# Altium project TimeHAT.PrjPcb
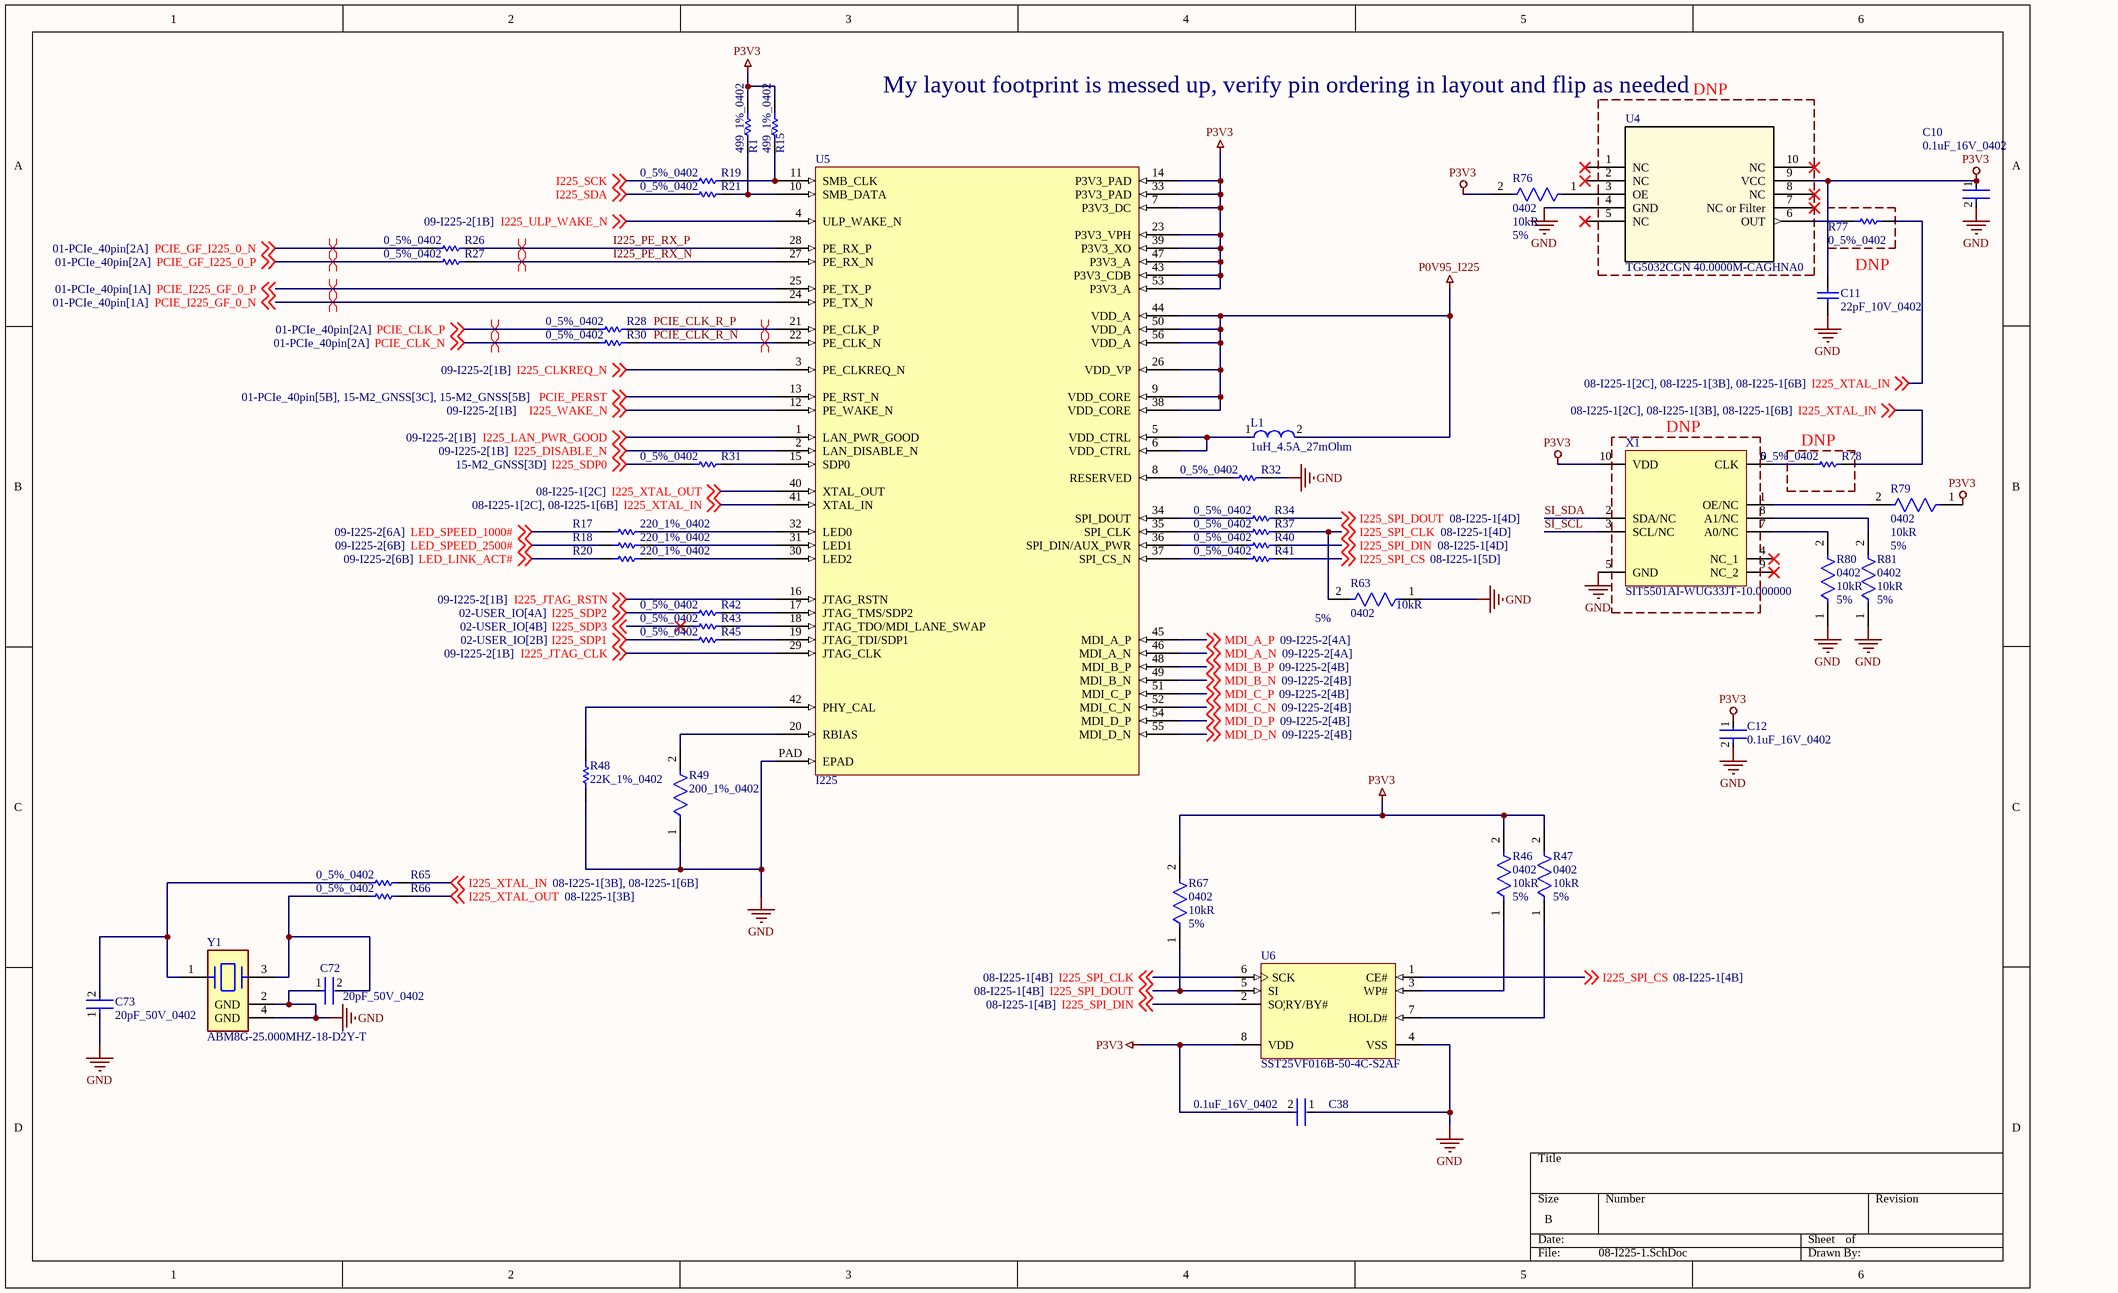
[diagram p0: 08-I225-1.SchDoc]
ProjectDate: 09/14/21; ProjectRevision: P3
3 sheets, 104 parts. Net scope: global (net labels, ports and power ports of the same name join across sheets).
Board file: TimeHAT.PcbDoc
Sheets:
  08-I225-1.SchDoc
  09-I225-2.SchDoc
  13-Power-P3V3.SchDoc

## Sheet 08-I225-1.SchDoc
size B; SheetNumber: 3; SheetTotal: 6

### Parts
C10  0.1uF_16V_0402  [FP-GRM15-MFG]
C11  22pF_10V_0402  [CAPC1005X56X25LL10T15]
C12  0.1uF_16V_0402  [FP-GRM15-MFG]
C38  0.1uF_16V_0402  [FP-GRM15-MFG]
C72  20pF_50V_0402  [FP-C0402-BB-MFG]
C73  20pF_50V_0402  [FP-C0402-BB-MFG]
L1  1uH_4.5A_27mOhm  [FP-IHLP-1616BZ-FP_1_8545x-MFG]
R1  499_1%_0402  [RESC1005X40X25LL05T05]
R15  499_1%_0402  [RESC1005X40X25LL05T05]
R17  220_1%_0402  [RESC1005X40X25NL10T10]
R18  220_1%_0402  [RESC1005X40X25NL10T10]
R19  0_5%_0402  [RESC1005X40X25LL10T10]
R20  220_1%_0402  [RESC1005X40X25NL10T10]
R21  0_5%_0402  [RESC1005X40X25LL10T10]
R26  0_5%_0402  [RESC1005X40X25LL10T10]
R27  0_5%_0402  [RESC1005X40X25LL10T10]
R28  0_5%_0402  [RESC1005X40X25LL10T10]
R30  0_5%_0402  [RESC1005X40X25LL10T10]
R31  0_5%_0402  [RESC1005X40X25LL10T10]
R32  0_5%_0402  [RESC1005X40X25LL10T10]
R34  0_5%_0402  [RESC1005X40X25LL10T10]
R37  0_5%_0402  [RESC1005X40X25LL10T10]
R40  0_5%_0402  [RESC1005X40X25LL10T10]
R41  0_5%_0402  [RESC1005X40X25LL10T10]
R42  0_5%_0402  [RESC1005X40X25LL10T10]
R43  0_5%_0402  [RESC1005X40X25LL10T10]
R45  0_5%_0402  [RESC1005X40X25LL10T10]
R46  Case/Package: 0402  Resistance: 10kR  Tolerance: 5%  [FP-CRCW0402-e3-IPC_B]  (hidden comment: CRCW040210K0JNED)
R47  Case/Package: 0402  Resistance: 10kR  Tolerance: 5%  [FP-CRCW0402-e3-IPC_B]  (hidden comment: CRCW040210K0JNED)
R48  22K_1%_0402  [RESC1005X40X25NL05T05]
R49  200_1%_0402  [FP-CRCW0402-e3-IPC_C]
R63  Case/Package: 0402  Resistance: 10kR  Tolerance: 5%  [FP-CRCW0402-e3-IPC_B]  (hidden comment: CRCW040210K0JNED)
R65  0_5%_0402  [RESC1005X40X25LL10T10]
R66  0_5%_0402  [RESC1005X40X25LL10T10]
R67  Case/Package: 0402  Resistance: 10kR  Tolerance: 5%  [FP-CRCW0402-e3-IPC_B]  (hidden comment: CRCW040210K0JNED)
R76  Case/Package: 0402  Resistance: 10kR  Tolerance: 5%  [FP-CRCW0402-e3-IPC_B]  (hidden comment: CRCW040210K0JNED)
R77  0_5%_0402  [RESC1005X40X25LL10T10]  (no BOM)
R78  0_5%_0402  [RESC1005X40X25LL10T10]  (no BOM)
R79  Case/Package: 0402  Resistance: 10kR  Tolerance: 5%  [FP-CRCW0402-e3-IPC_B]  (hidden comment: CRCW040210K0JNED)
R80  Case/Package: 0402  Resistance: 10kR  Tolerance: 5%  [FP-CRCW0402-e3-IPC_B]  (hidden comment: CRCW040210K0JNED)
R81  Case/Package: 0402  Resistance: 10kR  Tolerance: 5%  [FP-CRCW0402-e3-IPC_B]  (hidden comment: CRCW040210K0JNED)
U4  TG5032CGN 40.0000M-CAGHNA0  [QFN10_TG5032CGN 40.0000M-CAGHNA0_EPS]  (no BOM)
U5  I225  [I225 QFN56]
U6  SST25VF016B-50-4C-S2AF  [MCHP-SOIC-S2A8_M]
X1  SIT5501AI-WUG33JT-10.000000  [XTAL_SiT5501_70x50]  (no BOM)
Y1  ABM8G-25.000MHZ-18-D2Y-T  [FP-ABM8G-MFG]

### Blocks framed on the sheet
DNP: U4
DNP: X1

### Nets
GND: C10.2 C11.1 C12.2 C38.1 C72.1 C73.1 R32.2 R48.1 R49.1 R63.1 R80.1 R81.1 U4.4(GND) U5.PAD(EPAD) U6.4(VSS) X1.5(GND) Y1.2(GND) Y1.4(GND)
P0V95_I225: L1.2 U5.9(VDD_CORE) U5.26(VDD_VP) U5.38(VDD_CORE) U5.44(VDD_A) U5.50(VDD_A) U5.56(VDD_A)
P3V3: C10.1 C11.2 C12.1 C38.2 R1.2 R15.2 R46.2 R47.2 R67.2 R76.2 R79.1 U4.9(VCC) U5.7(P3V3_DC) U5.14(P3V3_PAD) U5.23(P3V3_VPH) U5.33(P3V3_PAD) U5.39(P3V3_XO) U5.43(P3V3_CDB) U5.47(P3V3_A) U5.53(P3V3_A) U6.8(VDD) X1.10(VDD)
I225_CLKREQ_N: U5.3(PE_CLKREQ_N) ; off-sheet I225_CLKREQ_N
I225_DISABLE_N: U5.2(LAN_DISABLE_N) ; off-sheet I225_DISABLE_N
I225_JTAG_CLK: U5.29(JTAG_CLK) ; off-sheet I225_JTAG_CLK
I225_JTAG_RSTN: U5.16(JTAG_RSTN) ; off-sheet I225_JTAG_RSTN
I225_LAN_PWR_GOOD: U5.1(LAN_PWR_GOOD) ; off-sheet I225_LAN_PWR_GOOD
I225_PE_RX_N: R27.2 U5.27(PE_RX_N)
I225_PE_RX_P: R26.2 U5.28(PE_RX_P)
I225_SCK: R19.1 ; off-sheet I225_SCK
I225_SDA: R21.1 ; off-sheet I225_SDA
I225_SDP0: R31.1 ; off-sheet I225_SDP0
I225_SDP1: R45.1 ; off-sheet I225_SDP1
I225_SDP2: R42.1 ; off-sheet I225_SDP2
I225_SDP3: R43.1 ; off-sheet I225_SDP3
I225_SPI_CLK: R37.2 R63.2 U6.6(SCK) ; off-sheet I225_SPI_CLK
I225_SPI_CS: R41.2 U6.1(CE#) ; off-sheet I225_SPI_CS
I225_SPI_DIN: R40.2 U6.2(SO|RY/BY#) ; off-sheet I225_SPI_DIN
I225_SPI_DOUT: R34.2 R67.1 U6.5(SI) ; off-sheet I225_SPI_DOUT
I225_ULP_WAKE_N: U5.4(ULP_WAKE_N) ; off-sheet I225_ULP_WAKE_N
I225_WAKE_N: U5.12(PE_WAKE_N) ; off-sheet I225_WAKE_N
I225_XTAL_IN: R65.2 R77.2 R78.2 U5.41(XTAL_IN) ; off-sheet I225_XTAL_IN
I225_XTAL_OUT: R66.2 U5.40(XTAL_OUT) ; off-sheet I225_XTAL_OUT
LED_LINK_ACT#: R20.1 ; off-sheet LED_LINK_ACT#
LED_SPEED_1000#: R17.1 ; off-sheet LED_SPEED_1000#
LED_SPEED_2500#: R18.1 ; off-sheet LED_SPEED_2500#
MDI_A_N: U5.46(MDI_A_N) ; off-sheet MDI_A_N
MDI_A_P: U5.45(MDI_A_P) ; off-sheet MDI_A_P
MDI_B_N: U5.49(MDI_B_N) ; off-sheet MDI_B_N
MDI_B_P: U5.48(MDI_B_P) ; off-sheet MDI_B_P
MDI_C_N: U5.52(MDI_C_N) ; off-sheet MDI_C_N
MDI_C_P: U5.51(MDI_C_P) ; off-sheet MDI_C_P
MDI_D_N: U5.55(MDI_D_N) ; off-sheet MDI_D_N
MDI_D_P: U5.54(MDI_D_P) ; off-sheet MDI_D_P
PCIE_CLK_N: R30.1 ; off-sheet PCIE_CLK_N
PCIE_CLK_P: R28.1 ; off-sheet PCIE_CLK_P
PCIE_CLK_R_N: R30.2 U5.22(PE_CLK_N)
PCIE_CLK_R_P: R28.2 U5.21(PE_CLK_P)
PCIE_GF_I225_0_N: R26.1 ; off-sheet PCIE_GF_I225_0_N
PCIE_GF_I225_0_P: R27.1 ; off-sheet PCIE_GF_I225_0_P
PCIE_I225_GF_0_N: U5.24(PE_TX_N) ; off-sheet PCIE_I225_GF_0_N
PCIE_I225_GF_0_P: U5.25(PE_TX_P) ; off-sheet PCIE_I225_GF_0_P
PCIE_PERST: U5.13(PE_RST_N) ; off-sheet PCIE_PERST
SI_SCL: X1.3(SCL/NC)
SI_SDA: X1.2(SDA/NC)
NetC72_2: C72.2 R66.1 Y1.3
NetC73_2: C73.2 R65.1 Y1.1
NetL1_1: L1.1 U5.5(VDD_CTRL) U5.6(VDD_CTRL)
NetR1_1: R1.1 R21.2 U5.10(SMB_DATA)
NetR15_1: R15.1 R19.2 U5.11(SMB_CLK)
NetR17_2: R17.2 U5.32(LED0)
NetR18_2: R18.2 U5.31(LED1)
NetR20_2: R20.2 U5.30(LED2)
NetR31_2: R31.2 U5.15(SDP0)
NetR32_1: R32.1 U5.8(RESERVED)
NetR34_1: R34.1 U5.34(SPI_DOUT)
NetR37_1: R37.1 U5.35(SPI_CLK)
NetR40_1: R40.1 U5.36(SPI_DIN/AUX_PWR)
NetR41_1: R41.1 U5.37(SPI_CS_N)
NetR42_2: R42.2 U5.17(JTAG_TMS/SDP2)
NetR43_2: R43.2 U5.18(JTAG_TDO/MDI_LANE_SWAP)
NetR45_2: R45.2 U5.19(JTAG_TDI/SDP1)
NetR46_1: R46.1 U6.3(WP#)
NetR47_1: R47.1 U6.7(HOLD#)
NetR48_2: R48.2 U5.42(PHY_CAL)
NetR49_2: R49.2 U5.20(RBIAS)
NetR76_1: R76.1 U4.3(OE)
NetR77_1: R77.1 U4.6(OUT)
NetR78_1: R78.1 X1.6(CLK)
NetR79_2: R79.2 X1.1(OE/NC)
NetR80_2: R80.2 X1.7(A0/NC)
NetR81_2: R81.2 X1.8(A1/NC)

Not connected (* = marked no-connect by the designer): U4 1(NC)* 2(NC)* 5(NC)* 7(NC_or_Filter)* 8(NC)* 10(NC)*; X1 4(NC_1)* 9(NC_2)*

### Layout directives
differential pair: I225_PE_RX_N, I225_PE_RX_P, PCIE_CLK_N, PCIE_CLK_P, PCIE_CLK_R_N, PCIE_CLK_R_P, PCIE_GF_I225_0_N, PCIE_GF_I225_0_P, PCIE_I225_GF_0_N, PCIE_I225_GF_0_P

### Notes on the sheet
- My layout footprint is messed up, verify pin ordering in layout and flip as needed
- DNP
- (near R78) DNP

### Library data of the parts
C10 C12 C38 = CMP-2100-03641-2: CAP CER 0.1UF 16V X7R 0402; Manufacturer Part Number: GRM155R71C104KA88D; Manufacturer: Murata; Standoff Height: 0mm; Tolerance: 10%; Voltage Rating: 16Vdc; Material: Ceramic; Capacitance: 0.10μF; Value: 0.10μF; RoHS: TRUE; Temperature Characteristic: X7R; Octopart: https://octopart.com/grm155r71c104ka88d-murata-196880; Digikey Description: CAP CER 0.1UF 16V X7R 0402; Device Class L3: Ceramic Capacitors; Height: 0.55mm; ComponentLink2Description: Datasheet; Temperature Range Low: -55°C; Ipc Land Pattern Name: CAPC10050X219; ComponentLink2URL: https://search.murata.co.jp/Ceramy/image/img/A01X/G101/ENG/GRM155R71H471KA01-01A.pdf; Device Class L1: Passive Components; Lead Free: yes; Category: Cap; Package: GRM15; Temperature: -55°C to +125°C; Device Class L2: Capacitors; Temperature Range High: +125°C; Mouser Description: 0402 0.1 uF 16V ±10 % Tolerance X7R SMT Multilayer Ceramic Capacitor
C11 = CMP-2008-02855-1: Part Number: 0402ZA220JAT2A; Manufacturer: AVX Interconnect / Elco
C72 C73 = CMP-1034-00890-3: CAP CER 20PF 50V 5% NP0 0402; Manufacturer Part Number: C0402C200J5GACTU; Manufacturer: Kemet; Tolerance: 0.05; Material: Ceramic; Temperature Characteristic: C0G; Temperature Coefficient: 15%; Octopart: https://octopart.com/c0402c200j5gactu-kemet-9143900; ComponentLink2Description: Datasheet; RoHS: TRUE; Ipc Land Pattern Name: CAPC10050X50; Temperature: -55°C to +125°C; Lead Free: Yes; Mouser Description: Multilayer Ceramic Capacitors MLCC - SMD/SMT 50volts 20pF C0G 5%; Device Class L1: Passive Components; Category: Cap; Package: C0402-BB; Temperature Range High: +125°C; Voltage Rating: 50 V; Temperature Range Low: -55°C; Device Class L2: Capacitors; Device Class L3: Ceramic Capacitors; Height: 0.55mm; Capacitance: 20 pF; Value: 20 pF; ComponentLink2URL: https://content.kemet.com/datasheets/KEM_C1002_X7R_SMD.pdf; Digikey Description: CAP CER 20PF 50V 5% NP0 0402; Automotive: No
L1 = CMP-02424-000223-1: Fixed Inductors Commercial Low DCR Series SMT 1uH 4.5A 27mΩ 20%; DC Resistance (DCR): 27mR; Core Material: Ferrite; Test Frequency: 100kHz; Shielding: Shielded; Self Resonant Frequency: 64MHz; Saturation Current: 5A; Inductance Tolerance: 20%; Min Operating Temperature: -55°C; Lead Free: Lead Free; Inductance: 1uH; Contact Plating: Tin; Package Quantity: 4000; Military Standard: Not; Depth: 4.31mm; Tolerance: 20%; RMS Current (Irms): 4.5A; Packaging: Tape and Reel; Number of Pins: 1616; Case/Package: 1616; Termination: SMD/SMT; Height: 2mm; Current Rating: 4.5A; Case Code (Metric): 4040; Max Operating Temperature: 125°C; Case Code (Imperial): 1616; Max DC Current: 4.5A; Width: 0.16inch; Mount: Surface Mount; Length: 4.7mm; Radiation Hardening: No; Height - Seated (Max): 0.079inch
R1 R15 = CMP-2002-00965-1: Manufacturer: Panasonic; Part Number: ERJ-2RKF4990X
R17 R18 R20 = CMP-2002-06050-1: Part Number: MC00625W04021220R; Manufacturer: Multicomp
R19 R21 R26-R28 R30-R32 R34 R37 R40-R43 R45 R65 R66 R77 R78 = CMP-2002-04569-1: Manufacturer: KOA Speer; Part Number: RK73Z1ETTP
R46 R47 R63 R67 R76 R79-R81 = CMP-2002-08136-3: RES Thick Film, 10kΩ, 5%, 0.063W, 200ppm/°C, 0402; Voltage Rating: 50V; Power Rating: 63mW; Military Standard: Not; Packaging: Tape and Reel; Case Code (Imperial): 0402; Min Operating Temperature: -55°C; Case Code (Metric): 1005; Temperature Coefficient: 200ppm/°C; Termination: SMD/SMT; Composition: Thick Film; Depth: 0.5mm; Number of Terminations: 2; Contact Plating: Tin; Height: 0.016inch; Width: 0.5mm; Max Operating Temperature: 155°C; Features: Automotive AEC-Q200; Length: 1mm; Radiation Hardening: No; Max Power Dissipation: 63mW; Mount: Surface Mount; Package Quantity: 1; Weight: 2.3E-05oz
R48 = CMP-1011-00659-2: Part Number: CRCW040222K0FKED; Manufacturer: Vishay Dale
R49 = CMP-1011-00429-3: RES Thick Film, 200Ω, 1%, 0.063W, 100ppm/°C, 0402; Max Power Dissipation: 63mW; Voltage Rating: 50V; Resistance: 200R; Termination: SMD/SMT; Weight: 2.3E-05oz; Case/Package: 0402; Contact Plating: Tin; Number of Pins: 2; Width: 0.5mm; Height: 0.35mm; Case Code (Metric): 1005; Military Standard: Not; Features: Automotive AEC-Q200; Power Rating: 63mW; Temperature Coefficient: 100ppm/°C; Tolerance: 1%; Lead Free: Lead Free; Depth: 0.5mm; Max Operating Temperature: 155°C; Min Operating Temperature: -55°C; Package Quantity: 10; Voltage Rating (DC): 50V; Composition: Thick Film; Mount: Surface Mount; Radiation Hardening: No; Length: 1mm; Packaging: Tape and Reel; Number of Terminations: 2; Case Code (Imperial): 0402
U4 = TG5032CGN 40.0000M-CAGHNA0: No Description Available; Mfr_Name: Epson; Copyright: Copyright (C) 2024 Ultra Librarian. All rights reserved.; Manufacturer_Part_Number: TG5032CGN 40.0000M-CAGHNA0; RefDes: RefDes; Type: DEV
U6 = CMP-0378-00041-1: 16 Mbit SPI Serial Flash, 2.7 to 3.6 V, 50 MHz, 0 to 70 degC, 8-pin SOIC (S2A8), Tube; Manufacturer: Microchip; PackageReference: SOIC-S2A8; PackageVersion: Rev. A; ComponentLink3URL: http://ww1.microchip.com/downloads/en/DeviceDoc/25051A.pdf; ComponentLink1Description: Manufacturer URL; ComponentLink4URL: http://www.microchip.com/SST25VF016B; ComponentLink1URL: http://www.microchip.com; DatasheetVersion: Rev. A; ComponentLink2URL: http://ww1.microchip.com/downloads/en/DeviceDoc/25044A.pdf; PackageDescription: 8-Lead Plastic Small Outline Intergrated Circuit, 5.275 x 5.275 mm Body, 1.27 mm Pitch; PartNumber: SST25VF016B-50-4C-S2AF; ComponentLink3Description: Package Specification; ComponentLink2Description: Datasheet; Mounting Technology: Surface Mount; ComponentLink4Description: Product URL
X1 = XTAL_SIT5501AI-WUG33JT-10.000000: 1 MHz  60 MHz, Elite X Stratum 3E Precision Oscillator; Manufacturer_Name: SiTime; Geometry.Height: 2.2mm; Manufacturer_Part_Number: SIT5501AI-WUG33JT-10.000000; Mouser Part Number: *; Mouser Price/Stock: *; Arrow Part Number: *; Arrow Price/Stock: *; Mouser Testing Part Number: *; Mouser Testing Price/Stock: *; Datasheet Link: https://www.sitime.com/support/resource-library/datasheets/sit5501-datasheet
Y1 = CMP-2000-05733-2: CRYSTAL 25.0000MHZ 18PF SMD; Manufacturer: Abracon; Stability: 30ppm; Frequency: 25MHz; Esr: 60Ω; Tolerance: 20ppm; Automotive: No; Series: ABM8G; Temperature Range High: +85°C; ComponentLink2URL: https://abracon.com/Resonators/ABM8G.pdf; RoHS: TRUE; Octopart: https://octopart.com/abm8g-25.000mhz-18-d2y-t-abracon-12676602; Package: ABM8G; Category: Crys; Device Class L2: Crystals / Oscillators; ComponentLink2Description: Datasheet; Manufacturer Part Number: ABM8G-25.000MHZ-18-D2Y-T; Height: 1mm; Lead Free: Yes; Digikey Description: CRYSTAL 25.0000MHZ 18PF SMD; Temperature Range Low: -40°C; Device Class L3: Crystals; Load Capacitance: 18pF; Temperature: -40°C to +85°C; Device Class L1: Passive Components; Mouser Description: Crystals 25.000MHz 18pF 30ppm -40C +85C

## Sheet 09-I225-2.SchDoc
size B; SheetNumber: 4; SheetTotal: 6
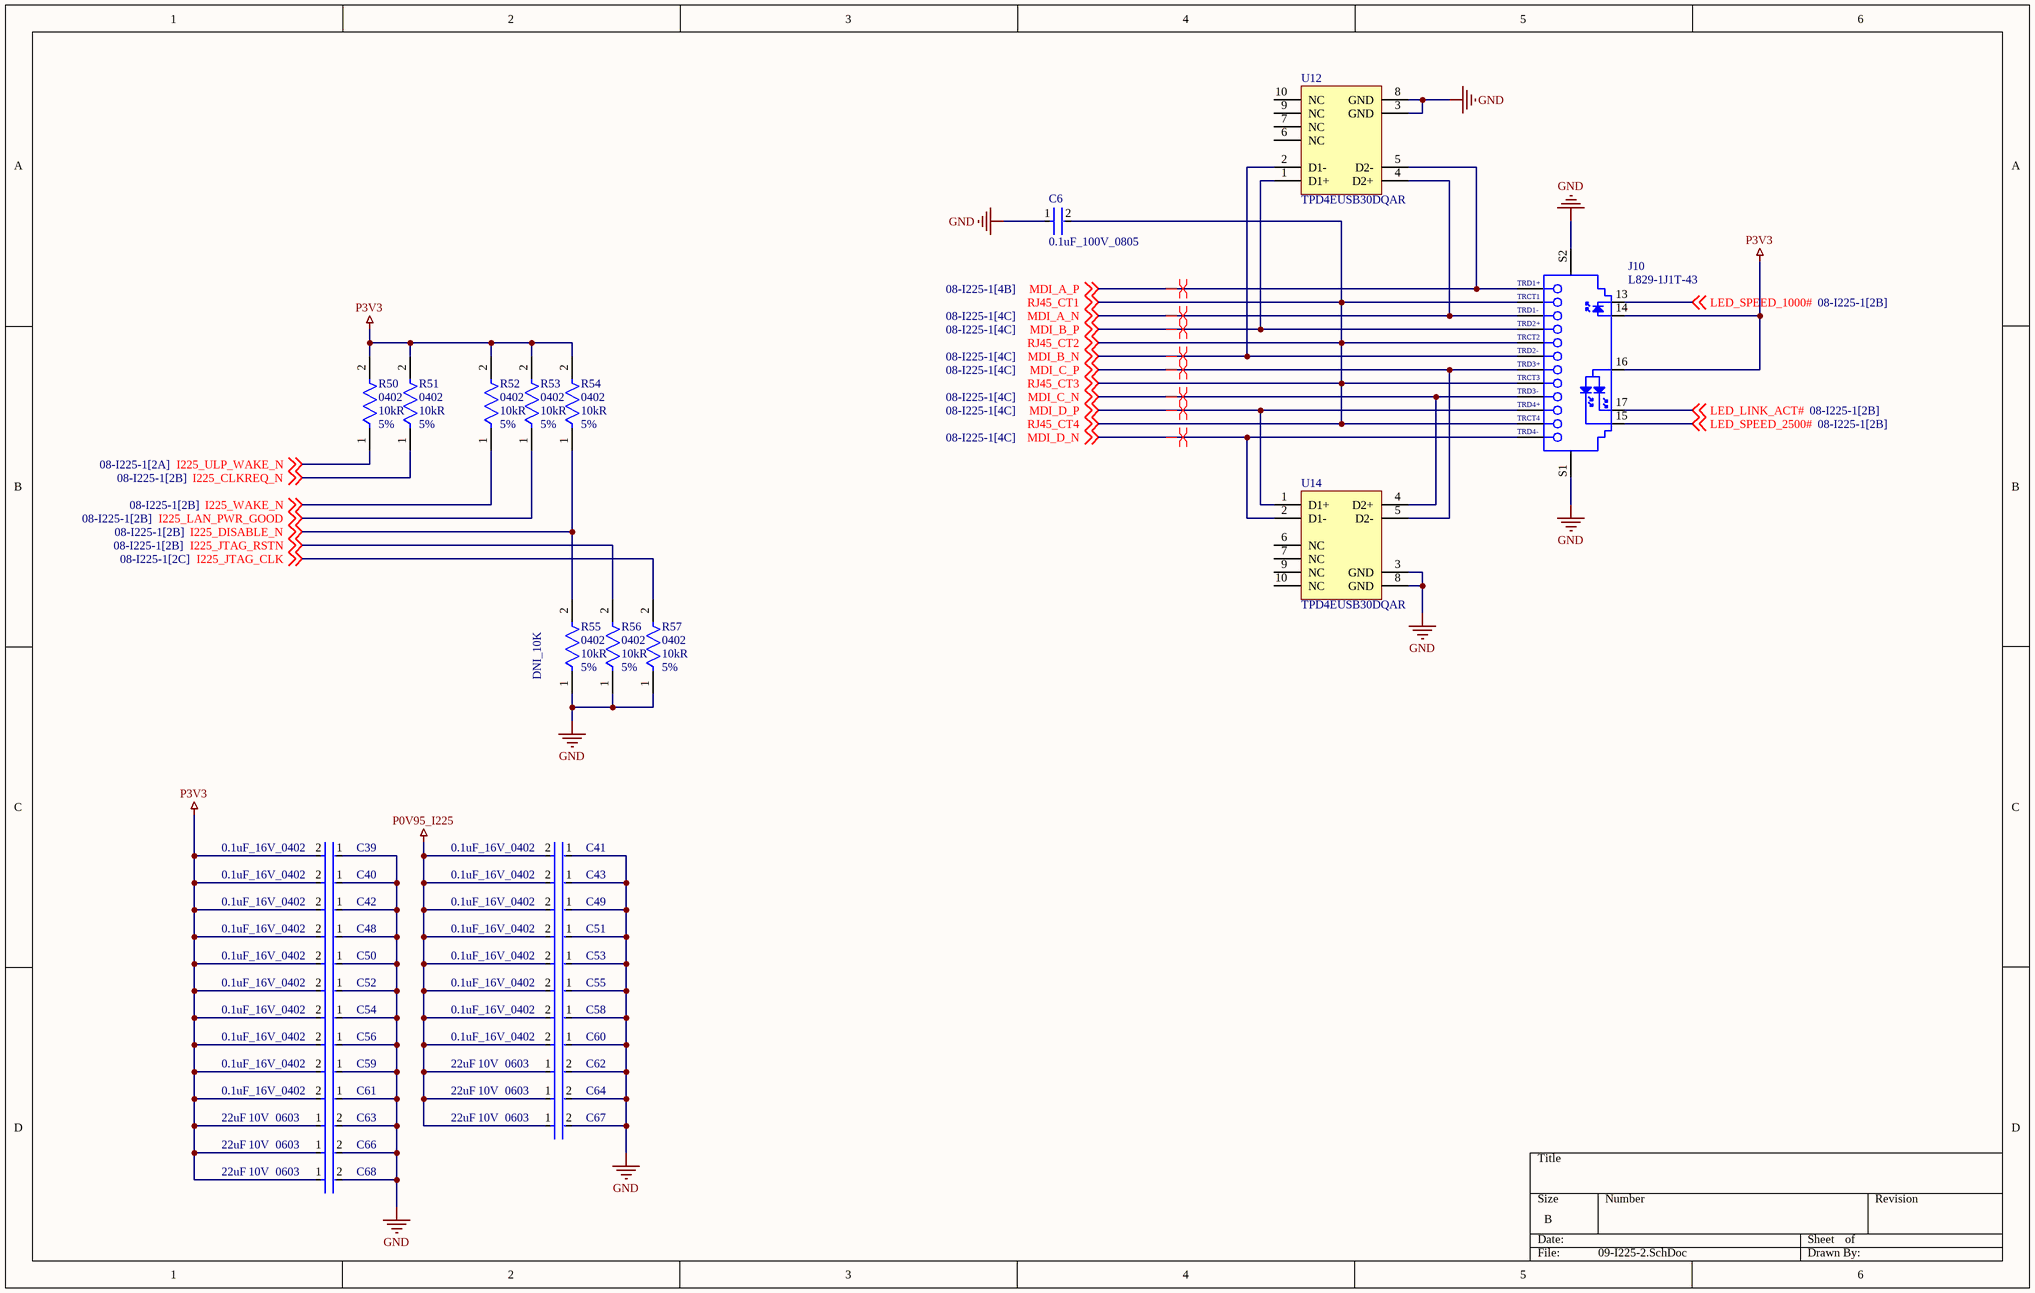
[diagram p1: 09-I225-2.SchDoc]

### Parts
C6  0.1uF_100V_0805  [FP-0805-L_2_0_0_1-W_1_25-MFG]
C39  0.1uF_16V_0402  [FP-GRM15-MFG]
C40  0.1uF_16V_0402  [FP-GRM15-MFG]
C41  0.1uF_16V_0402  [FP-GRM15-MFG]
C42  0.1uF_16V_0402  [FP-GRM15-MFG]
C43  0.1uF_16V_0402  [FP-GRM15-MFG]
C48  0.1uF_16V_0402  [FP-GRM15-MFG]
C49  0.1uF_16V_0402  [FP-GRM15-MFG]
C50  0.1uF_16V_0402  [FP-GRM15-MFG]
C51  0.1uF_16V_0402  [FP-GRM15-MFG]
C52  0.1uF_16V_0402  [FP-GRM15-MFG]
C53  0.1uF_16V_0402  [FP-GRM15-MFG]
C54  0.1uF_16V_0402  [FP-GRM15-MFG]
C55  0.1uF_16V_0402  [FP-GRM15-MFG]
C56  0.1uF_16V_0402  [FP-GRM15-MFG]
C58  0.1uF_16V_0402  [FP-GRM15-MFG]
C59  0.1uF_16V_0402  [FP-GRM15-MFG]
C60  0.1uF_16V_0402  [FP-GRM15-MFG]
C61  0.1uF_16V_0402  [FP-GRM15-MFG]
C62  Capacitance: 22uF  Voltage Rating: 10V  Case Code (Imperial): 0603  [FP-GRM188-0_2-IPC_C]  (hidden comment: GRM188R61A226ME15D)
C63  Capacitance: 22uF  Voltage Rating: 10V  Case Code (Imperial): 0603  [FP-GRM188-0_2-IPC_C]  (hidden comment: GRM188R61A226ME15D)
C64  Capacitance: 22uF  Voltage Rating: 10V  Case Code (Imperial): 0603  [FP-GRM188-0_2-IPC_C]  (hidden comment: GRM188R61A226ME15D)
C66  Capacitance: 22uF  Voltage Rating: 10V  Case Code (Imperial): 0603  [FP-GRM188-0_2-IPC_C]  (hidden comment: GRM188R61A226ME15D)
C67  Capacitance: 22uF  Voltage Rating: 10V  Case Code (Imperial): 0603  [FP-GRM188-0_2-IPC_C]  (hidden comment: GRM188R61A226ME15D)
C68  Capacitance: 22uF  Voltage Rating: 10V  Case Code (Imperial): 0603  [FP-GRM188-0_2-IPC_C]  (hidden comment: GRM188R61A226ME15D)
J10  L829-1J1T-43  [BELS-L829-1J1T-43_V]
R50  Case/Package: 0402  Resistance: 10kR  Tolerance: 5%  [FP-CRCW0402-e3-IPC_B]  (hidden comment: CRCW040210K0JNED)
R51  Case/Package: 0402  Resistance: 10kR  Tolerance: 5%  [FP-CRCW0402-e3-IPC_B]  (hidden comment: CRCW040210K0JNED)
R52  Case/Package: 0402  Resistance: 10kR  Tolerance: 5%  [FP-CRCW0402-e3-IPC_B]  (hidden comment: CRCW040210K0JNED)
R53  Case/Package: 0402  Resistance: 10kR  Tolerance: 5%  [FP-CRCW0402-e3-IPC_B]  (hidden comment: CRCW040210K0JNED)
R54  Case/Package: 0402  Resistance: 10kR  Tolerance: 5%  [FP-CRCW0402-e3-IPC_B]  (hidden comment: CRCW040210K0JNED)
R55  DNI_10K  Case/Package: 0402  Resistance: 10kR  Tolerance: 5%  [FP-CRCW0402-e3-IPC_B]  (no BOM)
R56  Case/Package: 0402  Resistance: 10kR  Tolerance: 5%  [FP-CRCW0402-e3-IPC_B]  (hidden comment: CRCW040210K0JNED)
R57  Case/Package: 0402  Resistance: 10kR  Tolerance: 5%  [FP-CRCW0402-e3-IPC_B]  (hidden comment: CRCW040210K0JNED)
U12  TPD4EUSB30DQAR  [DQA0010A_V]
U14  TPD4EUSB30DQAR  [DQA0010A_V]

### Nets
GND: C6.1 C39.1 C40.1 C41.1 C42.1 C43.1 C48.1 C49.1 C50.1 C51.1 C52.1 C53.1 C54.1 C55.1 C56.1 C58.1 C59.1 C60.1 C61.1 C62.2 C63.2 C64.2 C66.2 C67.2 C68.2 J10.S1 J10.S2 R55.1 R56.1 R57.1 U12.3(GND) U12.8(GND) U14.3(GND) U14.8(GND)
P0V95_I225: C41.2 C43.2 C49.2 C51.2 C53.2 C55.2 C58.2 C60.2 C62.1 C64.1 C67.1
P3V3: C39.2 C40.2 C42.2 C48.2 C50.2 C52.2 C54.2 C56.2 C59.2 C61.2 C63.1 C66.1 C68.1 J10.14 J10.16 R50.2 R51.2 R52.2 R53.2 R54.2
I225_CLKREQ_N: R51.1 ; off-sheet I225_CLKREQ_N
I225_DISABLE_N: R54.1 R55.2 ; off-sheet I225_DISABLE_N
I225_JTAG_CLK: R57.2 ; off-sheet I225_JTAG_CLK
I225_JTAG_RSTN: R56.2 ; off-sheet I225_JTAG_RSTN
I225_LAN_PWR_GOOD: R53.1 ; off-sheet I225_LAN_PWR_GOOD
I225_ULP_WAKE_N: R50.1 ; off-sheet I225_ULP_WAKE_N
I225_WAKE_N: R52.1 ; off-sheet I225_WAKE_N
LED_LINK_ACT#: J10.17 ; off-sheet LED_LINK_ACT#
LED_SPEED_1000#: J10.13 ; off-sheet LED_SPEED_1000#
LED_SPEED_2500#: J10.15 ; off-sheet LED_SPEED_2500#
MDI_A_N: J10.3(TRD1-) U12.4(D2+) ; off-sheet MDI_A_N
MDI_A_P: J10.1(TRD1+) U12.5(D2-) ; off-sheet MDI_A_P
MDI_B_N: J10.6(TRD2-) U12.2(D1-) ; off-sheet MDI_B_N
MDI_B_P: J10.4(TRD2+) U12.1(D1+) ; off-sheet MDI_B_P
MDI_C_N: J10.9(TRD3-) U14.4(D2+) ; off-sheet MDI_C_N
MDI_C_P: J10.7(TRD3+) U14.5(D2-) ; off-sheet MDI_C_P
MDI_D_N: J10.12(TRD4-) U14.2(D1-) ; off-sheet MDI_D_N
MDI_D_P: J10.10(TRD4+) U14.1(D1+) ; off-sheet MDI_D_P
RJ45_CT1: C6.2 J10.2(TRCT1) J10.5(TRCT2) J10.8(TRCT3) J10.11(TRCT4) ; off-sheet RJ45_CT1, off-sheet RJ45_CT2, off-sheet RJ45_CT3, off-sheet RJ45_CT4  [also labelled RJ45_CT2, RJ45_CT3, RJ45_CT4]

Not connected (* = marked no-connect by the designer): U12 6(NC) 7(NC) 9(NC) 10(NC); U14 6(NC) 7(NC) 9(NC) 10(NC)

### Layout directives
differential pair: MDI_A_N, MDI_A_P, MDI_B_N, MDI_B_P, MDI_C_N, MDI_C_P, MDI_D_N, MDI_D_P

### Library data of the parts
C6 = CMP-14477-005100-2: Multilayer Ceramic Capacitor 0.1 uF 100V X7R 20% SMD 0805 T/R; Capacitance: 100nF; Height: 1.25mm; RoHS Compliant: Yes; Construction: Flat; Width: 0.049inch; Series: M; Depth: 1.25mm; Case Code (Imperial): 0805; Dielectric: X7R; Resistor Type: Ceramic; Halogen Free: Halogen Free; Number of Pins: 2; Radiation Hardening: No; Max Operating Temperature: 125°C; Thickness: 0.053inch; Packaging: Tape and Reel; Package Quantity: 3000; Termination: SMD/SMT; Min Operating Temperature: -55°C; Voltage Rating: 100V; Mount: Surface Mount; Case/Package: 0805; Length: 2mm; Voltage Rating (DC): 100V; Tolerance: 20%; Case Code (Metric): 2012
C39-C43 C48-C56 C58-C61 = CMP-2100-03641-2: as C10 on sheet 08-I225-1; RoHS: TRUE; Temperature Characteristic: X7R; Octopart: https://octopart.com/grm155r71c104ka88d-murata-196880; Digikey Description: CAP CER 0.1UF 16V X7R 0402; Device Class L3: Ceramic Capacitors; Height: 0.55mm; ComponentLink2Description: Datasheet; Temperature Range Low: -55°C; Ipc Land Pattern Name: CAPC10050X219; ComponentLink2URL: https://search.murata.co.jp/Ceramy/image/img/A01X/G101/ENG/GRM155R71H471KA01-01A.pdf; Device Class L1: Passive Components; Lead Free: yes; Category: Cap; Package: GRM15; Temperature: -55°C to +125°C; Device Class L2: Capacitors; Temperature Range High: +125°C; Mouser Description: 0402 0.1 uF 16V ±10 % Tolerance X7R SMT Multilayer Ceramic Capacitor
C62-C64 C66-C68 = CMP-2000-06337-3: Chip Multilayer Ceramic Capacitors for General Purpose, 0603, 22uF, X5R, 15%, 20%, 10V; Tolerance: 20%; Weight: 0.000222oz; Material: Ceramic; Depth: 0.8mm; Length: 1.6mm; Termination: SMD/SMT; Packaging: Tape and Reel; Width: 0.8mm; Mount: Surface Mount; Voltage Rating (DC): 10V; Case/Package: 0603; Thickness: 0.039inch; REACH SVHC: No SVHC; Dielectric: X5R; Height: 0.8mm; Package Quantity: 4000; Case Code (Metric): 1608; Min Operating Temperature: -55°C; Lead Free: Lead Free; Max Operating Temperature: 85°C
J10 = CMP-1715-00001-1: Gigabit MagJack(R) Ultra Low Profile, 10/100/1000 Base-T, 19-Pin THD, RoHS, Tray; Width: 24.13 mm; RoHSCompliant: True; PartNumber: L829-1J1T-43; Case/Package: Metal; Mount: Through Hole; ComponentLink1Description: Manufacturer URL; Height: 11.3 mm; Package Quantity: 60; Packaging: Tray; Length: 17.78 mm; PackageDescription: 19-Pin Through Hole Device, Body 23.94 x 17.58 mm, Pitch 2.03 mm; ComponentLink2URL: http://belfuse.com/pdfs/L829-1J1T-43.pdf; ComponentLink1URL: http://belfuse.com/ethernet/; Mounting Technology: Through Hole; DatasheetVersion: Rev. G; Pins: 8; ComponentLink2Description: Datasheet
R50-R57 = CMP-2002-08136-3: as R46 on sheet 08-I225-1; Military Standard: Not; Packaging: Tape and Reel; Case Code (Imperial): 0402; Min Operating Temperature: -55°C; Case Code (Metric): 1005; Temperature Coefficient: 200ppm/°C; Termination: SMD/SMT; Composition: Thick Film; Depth: 0.5mm; Number of Terminations: 2; Contact Plating: Tin; Height: 0.016inch; Width: 0.5mm; Max Operating Temperature: 155°C; Features: Automotive AEC-Q200; Length: 1mm; Radiation Hardening: No; Max Power Dissipation: 63mW; Mount: Surface Mount; Package Quantity: 1; Weight: 2.3E-05oz
U12 U14 = CMP-0326-00027-3: ESD Solution for Super-Speed (6 GBPS) USB 3.0 Interface, 4 Channels, -40 to +85 degC, 10-pin SON (DQA), Green (RoHS & no Sb/Br); Manufacturer: Texas Instruments; Differential Capacitance(pF): 0.05; Serial ATA / eSATA: TRUE; IO Capacitance(Typ)(pF): 0.8; IO Leakage Current(nA): 10; IEC 61000-4-2 Air-Gap(+/- kV): 8; ComponentLink3Description: URL Link1; PartNumber: TPD4EUSB30DQAR; DatasheetVersion: SLVSAC2C; ComponentLink2URL: http://www.ti.com/general/docs/lit/getliterature.tsp?genericPartNumber=TPD4EUSB30&fileType=pdf; USB Super Speed: TRUE; Eco-Plan: Green (RoHS & no Sb/Br); Mounting Technology: Surface Mount; 1394 / Firewire: TRUE; PackageVersion: revB, Sep-2009; SubFamily: ESD Solution; USB Full Speed: TRUE; USB High Speed: TRUE; ComponentLink2Description: Datasheet; ComponentLink1URL: http://www.ti.com/; IEC 61000-4-2 Contact(+/- kV): 8; Breakdown Voltage(Min)(V): 8; PackageReference: DQA0010A; ComponentLink1Description: Manufacturer URL; PackageDescription: 10-Pin Plastic Small Outline No-Lead, 1 x 2.5 x 0.55 mm Body, 0.5 mm Pitch; ComponentLink3URL: SamplesURL:http://www.ti.com/product/tpd4eusb30#samples; HDMI: TRUE

## Sheet 13-Power-P3V3.SchDoc
size B; SheetNumber: 5; SheetTotal: 6; SPICEModelCacheMBQUAUON: <root> / <DocumentId>MBQUAUON</DocumentId> / <CacheFrame Number="0"> / <Model Name="emk105bj105_v-f" Kind="CKT"> / <Text>* EMK105BJ105_V-F     SPICE MODEL  ( General Type ) / *-------------------------------------------------------------------------------------------------------- / * Model Generated by TAIYO YUDEN Corporation (http://www.ty-top.com) / * Version 1.0 / * TAIYO YUDEN Control No. 170508_130520 / * Copyright(c) 2012 TAIYO YUDEN CO.,LTD. All Rights Reserved. / *-------------------------------------------------------------------------------------------------------- / * / * Products Name : Multilayer Ceramic Capacitors / * / * Characteristics : / *     Capacitance : 1 uF , Rated Voltage : 16V , TCC : X5R / *     Case Size : 1.0 x 0.5 / 0.039 x 0.02 [mm/inch] , Thickness : 0.5 / 0.02 [mm/inch] / *     (Conditions: Temperature = 25 degC , DC Bias Current/Voltage = 0A / 0V) / * / * Frequency Range : 40Hz - 3GHz / * / * External Node Assignments : / * / *  1  o---| |---o  2 / * / *-------------------------------------------------------------------------------------------------------- / .SubCkt EMK105BJ105_V-F 1 2 / **************************** / C0 1 110 0.68309u / Cm 1 101 0.26053u / C1 101 102 0.94076u / Rc1 101 102 1.9029k / C2 102 103 0.66707u / Rc2 102 103 120.36 / C3 103 110 0.57203u / Rc3 103 110 2.1097 / C2m 1 301 0.1871u / C21 301 302 3.2494u / Rc21 301 302 1.1117k / C22 302 303 2.1014u / Rc22 302 303 1.484k / C23 303 304 2.1172u / Rc23 303 304 1.3876k / C24 304 305 0.75729u / Rc24 304 305 332.59 / C25 305 306 0.94401u / Rc25 305 306 249.09 / C26 306 307 0.34674u / Rc26 306 307 28.352 / C27 307 308 0.37158u / Rc27 307 308 19.989 / C28 308 309 0.17933u / Rc28 308 309 31.748 / C29 309 110 0.016445u / Rc29 309 110 1.0592 / Rp0 1 110 100Meg / L0 110 120 0.2216n / Lm 120 130 0.1509n / L1 120 121 0.12659n / RL1 121 130 0.85161 / L2 120 122 0.15996n / RL2 122 130 0.42469 / L3 120 123 7.9543n / RL3 123 130 0.54643m / CR 120 124 0.24334u / LR 124 125 0.090738n / RR 125 130 68.076m / CL 130 140 2.7354p / LL 130 140 0.10762n / RL 130 140 50.614 / Rs 140 2 7.5416m / **************************** / .ends EMK105BJ105_V-F</Text> / </Model> / </CacheFrame> / </root>
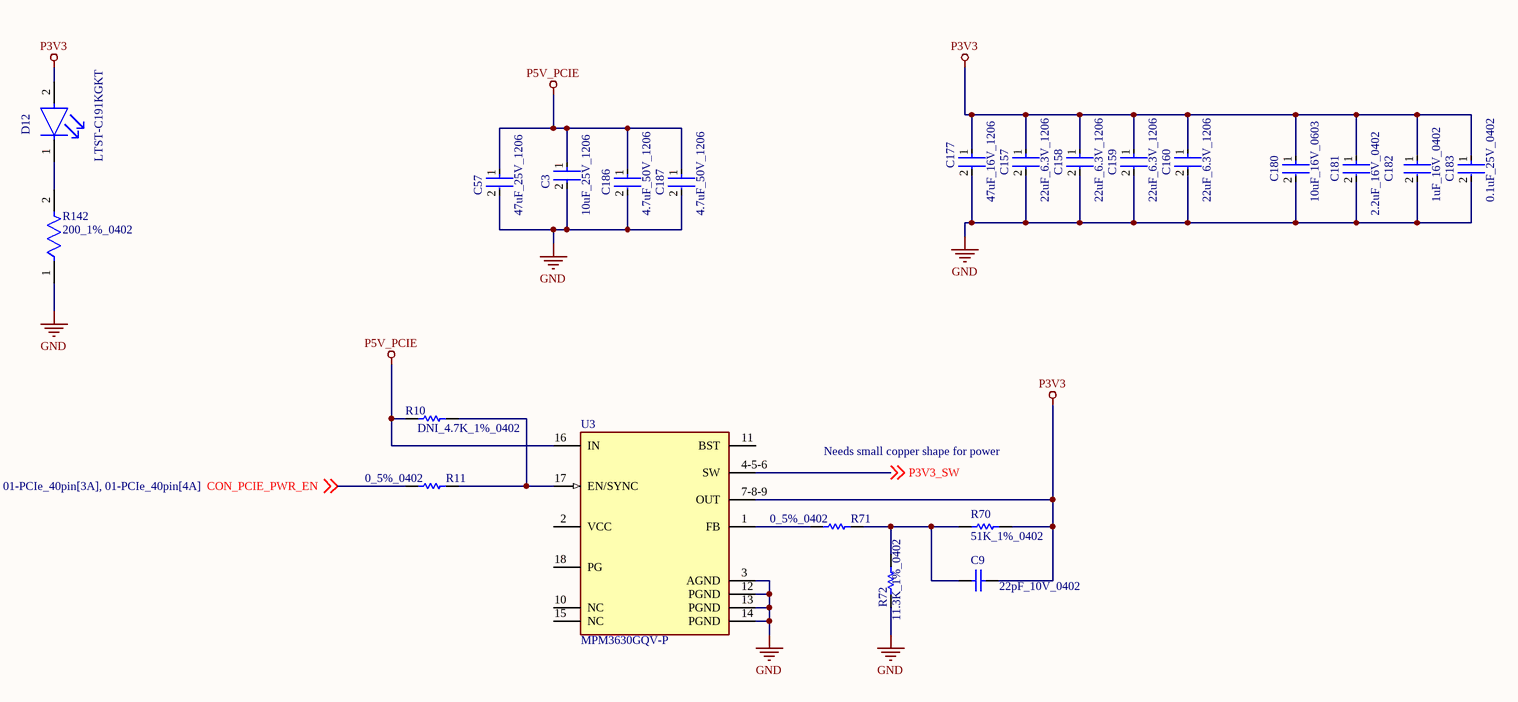
[diagram p2: 13-Power-P3V3.SchDoc]

### Parts
C3  10uF_25V_1206  [FP-1206-L_3_2_0_2-W_1_6_0-IPC_A]
C9  22pF_10V_0402  [CAPC1005X56X25LL10T15]
C57  47uF_25V_1206  [FP-C3216-160-0_2-MFG]
C157  22uF_6.3V_1206  [FP-1206-L_3_2_0_2-W_1_6_0-IPC_C]
C158  22uF_6.3V_1206  [FP-1206-L_3_2_0_2-W_1_6_0-IPC_C]
C159  22uF_6.3V_1206  [FP-1206-L_3_2_0_2-W_1_6_0-IPC_C]
C160  22uF_6.3V_1206  [FP-1206-L_3_2_0_2-W_1_6_0-IPC_C]
C177  47uF_16V_1206  [FP-C3216-160-0_2-MFG]
C180  10uF_16V_0603  [FP-0603-L_1_6_0_2-W_0_8_0-MFG]
C181  2.2uF_16V_0402  [FP-C1005-050-0_05-IPC_A]
C182  1uF_16V_0402  [FP-0402-L_1_0_0_05-W_0_5-IPC_A]
C183  0.1uF_25V_0402  [FP-0402-L_1_0_1-W_0_5_0_1-IPC_C]
C186  4.7uF_50V_1206  [FP-GRM31C-0_2-e0_3_0_8-IPC_C]
C187  4.7uF_50V_1206  [FP-GRM31C-0_2-e0_3_0_8-IPC_C]
D12  LTST-C191KGKT  [FP-LTST-C191KGKT-MFG]
R10  DNI_4.7K_1%_0402  [RESC1005X40X25NL10T10]  (no BOM)
R11  0_5%_0402  [RESC1005X40X25LL10T10]
R70  51K_1%_0402  [RESC1005X40X25ML10T10]
R71  0_5%_0402  [RESC1005X40X25LL10T10]
R72  11.3K_1%_0402  [RESC1005X40X25LL10T10]
R142  200_1%_0402  [FP-ERJ2RK-IPC_A]
U3  MPM3630GQV-P  [FP-MPM3630GQV-P-MFG]

### Nets
GND: C3.2 C57.2 C157.2 C158.2 C159.2 C160.2 C177.2 C180.2 C181.2 C182.2 C183.2 C186.2 C187.2 R72.2 R142.1 U3.3(AGND) U3.12(PGND) U3.13(PGND) U3.14(PGND)
P3V3: C9.2 C157.1 C158.1 C159.1 C160.1 C177.1 C180.1 C181.1 C182.1 C183.1 D12.2(A) R70.2 U3.7-8-9(OUT)
P5V_PCIE: C3.1 C57.1 C186.1 C187.1 R10.1 U3.16(IN)
CON_PCIE_PWR_EN: R11.1 ; off-sheet CON_PCIE_PWR_EN
P3V3_SW: U3.4-5-6(SW) ; off-sheet P3V3_SW
NetC9_1: C9.1 R70.1 R71.2 R72.1
NetD12_1: D12.1(C) R142.2
NetR10_2: R10.2 R11.2 U3.17(EN/SYNC)
NetR71_1: R71.1 U3.1(FB)

Not connected (* = marked no-connect by the designer): U3 2(VCC) 10(NC) 11(BST) 15(NC) 18(PG)

### Notes on the sheet
- Needs small copper shape for power

### Library data of the parts
C3 = CMP-04427-006943-1: General Purpose Ceramic Capacitor, 1206, 10uF, 20%, X5R, 15%, 25V; Dissipation Factor: 12.5%; Insulation Resistance: 10GR; Case Code (Imperial): 1206; Series: -; Construction: Flat; Termination: SMD/SMT; Case/Package: 1206; Dielectric: X5R; Width: 1.6mm; Max Operating Temperature: 85°C; Height: 0.07mm; Package Quantity: 1; Depth: 1.6mm; Voltage Rating: 25V; Capacitance: 10uF; RoHS Compliant: Yes; Mount: Surface Mount; Radiation Hardening: No; Voltage Rating (DC): 25V; Number of Pins: 2; Contact Plating: Tin; Min Operating Temperature: -55°C; Lead Free: Lead Free; Packaging: Tape and Reel; Tolerance: 20%; Case Code (Metric): 3216; Thickness: 0.07inch; Length: 3.2mm; REACH SVHC: No SVHC
C9 = CMP-2008-02855-1: as C11 on sheet 08-I225-1
C57 = CMP-2000-05397-3: Multilayer Ceramic Capacitors 47uF ±20% 25V X5R SMD 1206; Weight: 0.000571oz; Dielectric: X5R; Length: 0.126inch; Voltage Rating: 25V; Case/Package: 1206; Dielectric Material: Ceramic; Min Operating Temperature: -55°C; Lead Free: Lead Free; Packaging: Tape and Reel; Package Quantity: 1; Mount: Surface Mount; Depth: 1.6mm; REACH SVHC: No SVHC; Termination: SMD/SMT; Case Code (Imperial): 1206; Series: C; Resistor Type: Ceramic; Voltage: 25V; Width: 0.063inch; Height: 1.6mm; Tolerance: 20%; Capacitance: 47uF; Max Operating Temperature: 85°C; Voltage Rating (DC): 25V; RoHS Compliant: Yes; Thickness: 0.071inch; Case Code (Metric): 3216
C157-C160 = CMP-2000-05869-2: General Purpose Ceramic Capacitor, 1206, 22uF, 20%, X5R, 15%, 6.3V; Lead Free: Lead Free; Case Code (Metric): 3216; Case/Package: 1206; Depth: 1.6mm; Capacitance: 22uF; Length: 3.2mm; Series: -; Contact Plating: Tin; Tolerance: 20%; REACH SVHC: No SVHC; Radiation Hardening: No; RoHS Compliant: Yes; Termination: SMD/SMT; Voltage Rating: 6.3V; Packaging: Tape and Reel; Voltage: 6.3V; Mount: Surface Mount; Thickness: 0.07inch; Package Quantity: 1; Voltage Rating (DC): 6.3V; Case Code (Imperial): 1206; Construction: Flat; Dielectric: X5R; Number of Pins: 2; Min Operating Temperature: -55°C; Height: 0.07mm; Width: 0.063inch; Max Operating Temperature: 85°C
C177 = CMP-2000-07442-2: Multilayer Ceramic Capacitors 47uF ±20% 16V X5R SMD 1206; Resistor Type: Ceramic; Width: 0.063inch; Case Code (Imperial): 1206; Radiation Hardening: No; Thickness: 0.071inch; Dielectric: X5R; Weight: 0.000571oz; Termination: SMD/SMT; Dielectric Material: Ceramic; Min Operating Temperature: -55°C; Depth: 1.6mm; Case Code (Metric): 3216; Max Operating Temperature: 85°C; RoHS Compliant: Yes; REACH SVHC: No SVHC; Mount: Surface Mount; Lead Free: Lead Free; Height: 1.6mm; Length: 3.2mm; Tolerance: 20%; Voltage Rating (DC): 16V; Capacitance: 47uF; Package Quantity: 1; Construction: Flat; Packaging: Tape and Reel; Series: C; Case/Package: 1206; Voltage Rating: 16V
C180 = CMP-2000-06226-4: Multilayer Ceramic Capacitor 10uF 16V X5R 20% SMD 0603 T/R; Packaging: Tape and Reel; Construction: Flat; Height: 0.8mm; Max Operating Temperature: 85°C; Dielectric: X5R; Case Code (Metric): 1608; Voltage Rating (DC): 16V; Width: 0.031inch; Voltage Rating: 16V; Length: 0.063inch; RoHS Compliant: Yes; Halogen Free: Halogen Free; Case Code (Imperial): 0603; Capacitance: 10uF; Mount: Surface Mount; Thickness: 0.031inch; Tolerance: 20%; Min Operating Temperature: -55°C; Series: M; Termination: SMD/SMT; Case/Package: 0603; Package Quantity: 1
C181 = CMP-2000-05998-2: Multilayer Ceramic Capacitors 2.2μF ±10% 16V X5R SMD 0402; Capacitance: 2.2uF; REACH SVHC: No SVHC; Series: C; Termination: SMD/SMT; Case Code (Imperial): 0402; Depth: 0.5mm; Mount: Surface Mount; Width: 0.02inch; Package Quantity: 1; Dielectric Material: Ceramic; Length: 1mm; Packaging: Tape and Reel; Case Code (Metric): 1005; RoHS Compliant: Yes; Dielectric: X5R; Max Operating Temperature: 85°C; Lead Free: Lead Free; Weight: 2.3E-05oz; Thickness: 0.022inch; Voltage Rating (DC): 16V; Tolerance: 10%; Voltage Rating: 16V; Resistor Type: Ceramic; Height: 0.5mm; Case/Package: 0402; Min Operating Temperature: -55°C
C182 = CMP-14477-000104-2: None; Tolerance: 10%; Voltage Rating: 16V; Dielectric: X5R; Capacitance: 1uF; Packaging: Tape and Reel; Depth: 0.5mm; Mount: Surface Mount; Thickness: 0.022inch; Package Quantity: 1; Min Operating Temperature: -55°C; Series: M; Voltage Rating (DC): 16V; Termination: SMD/SMT; Case/Package: 0402; Number of Pins: 2; Case Code (Imperial): 0402; Length: 1mm; Halogen Free: Halogen Free; Case Code (Metric): 1005; Width: 0.02inch; RoHS Compliant: Yes; Radiation Hardening: No; Max Operating Temperature: 85°C; Height: 0.5mm; Construction: Flat
C183 = CMP-2008-02519-2: General Purpose Ceramic Capacitor, 0402, 100nF, 10%, X7R, 15%, 25V; Package Quantity: 1; Capacitance: 100nF; Min Operating Temperature: -55°C; Voltage: 25V; Voltage Rating: 25V; Construction: Flat; Max Operating Temperature: 125°C; Radiation Hardening: No; Depth: 0.5mm; Thickness: 0.022inch; Voltage Rating (DC): 25V; Number of Pins: 2; Lead Free: Lead Free; Series: -; REACH SVHC: No SVHC; Length: 1mm; Dielectric: X7R; RoHS Compliant: Yes; Mount: Surface Mount; Packaging: Tape and Reel; Case/Package: 0402; Case Code (Imperial): 0402; Termination: SMD/SMT; Width: 0.02inch; Case Code (Metric): 1005; Tolerance: 10%
C186 C187 = CMP-1037-04923-3: Chip Multilayer Ceramic Capacitors for General Purpose, 1206, 4.7uF, X7R, 15%, 10%, 50V; Height: 1.6mm; Voltage: 50V; Capacitance: 4.7uF; Lead Free: Lead Free; Max Operating Temperature: 125°C; Packaging: Tape and Reel; REACH SVHC: No SVHC; Voltage Rating: 50V; Mount: Surface Mount; Termination: SMD/SMT; Tolerance: 10%; Case/Package: 1206; Material: Ceramic; Depth: 1.6mm; Length: 3.2mm; Case Code (Metric): 3216; Voltage Rating (DC): 50V; Case Code (Imperial): 1206; Radiation Hardening: No; Width: 0.063inch; Thickness: 0.071inch; Package Quantity: 2000; Min Operating Temperature: -55°C; Dielectric: X7R
D12 = CMP-2000-05198-2: LED GREEN CLEAR SMD; Max Power Dissipation: 75mW; Forward Current: 30mA; Reverse Voltage: 5V; Lens Color: Colorless; Forward Voltage: 2V; Dominant Wavelength: 571nm; Number of LEDs: 1; Viewing Angle: 130°; Lens Style: Rectangular; Test Current: 20mA; Luminous Intensity: 35mcd; Wavelength: 574nm; Width: 0.8mm; Case Code (Imperial): 0603; Number of Pins: 2; Lead Free: Lead Free; Packaging: Tape and Reel; Package Quantity: 1; Min Operating Temperature: -55°C; Case/Package: 0603; Length: 1.6mm; Power Dissipation: 75mW; Depth: 0.8mm; Radiation Hardening: No; Mount: Surface Mount; Max Operating Temperature: 85°C; Color: Green; Power Rating: 75mW; Height: 0.55mm; Illumination Color: Green; Case Code (Metric): 1608; Lens Transparency: Clear; Number of Elements: 1
R10 = CMP-2002-05217-1: Manufacturer: Bourns; Part Number: CR0402-FX-4701GLF
R11 R71 = CMP-2002-04569-1: as R19 on sheet 08-I225-1
R70 = CMP-2002-04458-1: Manufacturer: KOA Speer; Part Number: RK73H1ETTP5102F
R72 = CMP-2002-04194-1: Part Number: RK73H1ETTP1132F; Manufacturer: KOA Speer
R142 = CMP-2002-00757-2: RES SMD 200 OHM 1% 1/10W 0402; Power Rating: 100mW; Voltage Rating (DC): 50V; Resistance: 200R; Temperature Coefficient: 100ppm/°C; RoHS Compliant: Yes; Packaging: Tape and Reel; Case Code (Metric): 1005; Package Quantity: 1; Contact Plating: Tin; Series: ERJ; Mount: Surface Mount; Lead Free: Lead Free; Min Operating Temperature: -55°C; Number of Terminations: 2; Max Power Dissipation: 100mW; Technology: THICK FILM; Voltage Rating: 50V; Case/Package: 0402; Width: 0.02inch; Termination: SMD/SMT; Military Standard: Not; Height: 0.35mm; Radiation Hardening: No; Resistance Tolerance: 1%; Length: 1mm; REACH SVHC: No SVHC; Construction: Rectangular; Depth: 0.5mm; Features: Automotive AEC-Q200; Resistor Type: Thick Film; Case Code (Imperial): 0402; Tolerance: 1%; Size Code: 0402; Max Operating Temperature: 155°C
U3 = CMP-57379-000007-1: DC DC CONVERTER 0.6-18V; Max Output Current: 3A; Max Input Voltage: 18V; Number of Outputs: 1; Min Input Voltage: 4.5V; Features: UVLO; Case/Package: QFN; Mount: Surface Mount; Min Operating Temperature: -40°C; Max Operating Temperature: 125°C; Packaging: Tape and Reel; Voltage - Output 1: 18V

## Nets that join several sheets
GND: 08-I225-1 (18 pins), 09-I225-2 (34 pins), 13-Power-P3V3 (19 pins)
P0V95_I225: 08-I225-1 (7 pins), 09-I225-2 (11 pins)
P3V3: 08-I225-1 (22 pins), 09-I225-2 (20 pins), 13-Power-P3V3 (13 pins)
I225_CLKREQ_N: 08-I225-1 (U5.3), 09-I225-2 (R51.1)
I225_DISABLE_N: 08-I225-1 (U5.2), 09-I225-2 (R54.1 R55.2)
I225_JTAG_CLK: 08-I225-1 (U5.29), 09-I225-2 (R57.2)
I225_JTAG_RSTN: 08-I225-1 (U5.16), 09-I225-2 (R56.2)
I225_LAN_PWR_GOOD: 08-I225-1 (U5.1), 09-I225-2 (R53.1)
I225_ULP_WAKE_N: 08-I225-1 (U5.4), 09-I225-2 (R50.1)
I225_WAKE_N: 08-I225-1 (U5.12), 09-I225-2 (R52.1)
LED_LINK_ACT#: 08-I225-1 (R20.1), 09-I225-2 (J10.17)
LED_SPEED_1000#: 08-I225-1 (R17.1), 09-I225-2 (J10.13)
LED_SPEED_2500#: 08-I225-1 (R18.1), 09-I225-2 (J10.15)
MDI_A_N: 08-I225-1 (U5.46), 09-I225-2 (J10.3 U12.4)
MDI_A_P: 08-I225-1 (U5.45), 09-I225-2 (J10.1 U12.5)
MDI_B_N: 08-I225-1 (U5.49), 09-I225-2 (J10.6 U12.2)
MDI_B_P: 08-I225-1 (U5.48), 09-I225-2 (J10.4 U12.1)
MDI_C_N: 08-I225-1 (U5.52), 09-I225-2 (J10.9 U14.4)
MDI_C_P: 08-I225-1 (U5.51), 09-I225-2 (J10.7 U14.5)
MDI_D_N: 08-I225-1 (U5.55), 09-I225-2 (J10.12 U14.2)
MDI_D_P: 08-I225-1 (U5.54), 09-I225-2 (J10.10 U14.1)